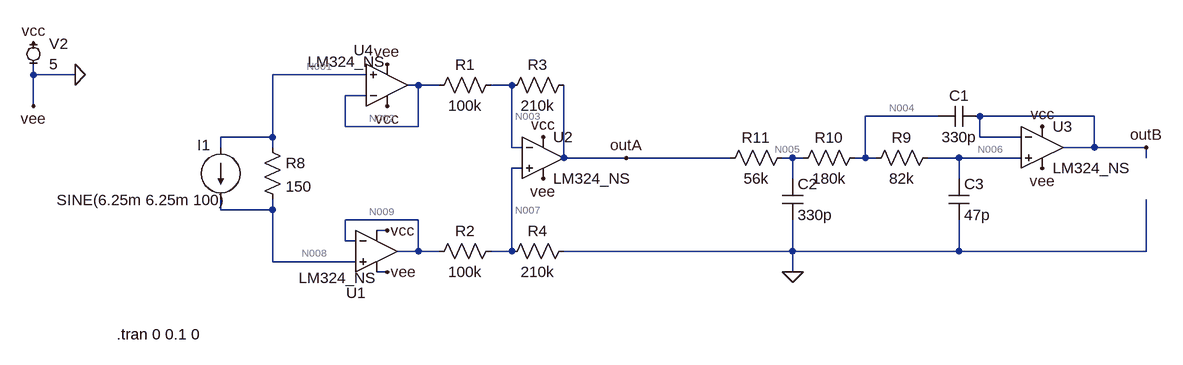
[diagram p0: schematic current_sense_alt.asc]
* current_sense_alt.asc
R3 N003 outA 210k
R4 N007 0 210k
V2 vcc 0 5
R8 N001 N008 150
I1 N001 N008 SINE(6.25m 6.25m 100)
C1 N004 outB 330p
R9 N004 N006 82k
R10 N005 N004 180k
R11 outA N005 56k
C2 N005 0 330p
C3 N006 0 47p
* U1: LM324_NS (symbol EXTRA\ExtraOpamps\LM324_NS not available, pins judged from their places): In+=N008 In-=N009 V+=vcc V-=0 OUT=N009
* U2: LM324_NS (symbol EXTRA\ExtraOpamps\LM324_NS not available, pins judged from their places): In+=N007 In-=N003 V+=vcc V-=0 OUT=outA
* U3: LM324_NS (symbol EXTRA\ExtraOpamps\LM324_NS not available, pins judged from their places): In+=N006 In-=outB V+=vcc V-=0 OUT=outB
* U4: LM324_NS (symbol EXTRA\ExtraOpamps\LM324_NS not available, pins judged from their places): In+=N001 In-=N002 V+=vcc V-=0 OUT=N002
R1 N003 N002 100k
R2 N007 N009 100k
.tran 0 0.1 0
.backanno
.end

* Results of the author's LTspice run, read from the files saved beside the schematic
* Operating Point, zero values left out:
*   V(n003) = 2.724 V
*   V(outa) = 1.84 V
*   V(n007) = 2.722 V
*   V(vcc) = 5 V
*   V(n001) = 3.139 V
*   V(n008) = 4.076 V
*   V(n004) = 1.852 V
*   V(outb) = 1.859 V
*   V(n006) = 1.857 V
*   V(n005) = 1.843 V
*   V(n009) = 4.012 V
*   V(n002) = 3.141 V
*   I(I1) = 6.25 mA
*   I(R2) = -12.91 µA
*   I(R1) = -4.169 µA
*   I(R11) = -51.94 nA
*   I(R10) = -51.94 nA
*   I(R9) = -51.94 nA
*   I(R8) = -6.25 mA
*   I(R4) = 12.96 µA
*   I(R3) = 4.207 µA
*   I(V2) = 178.7 µA
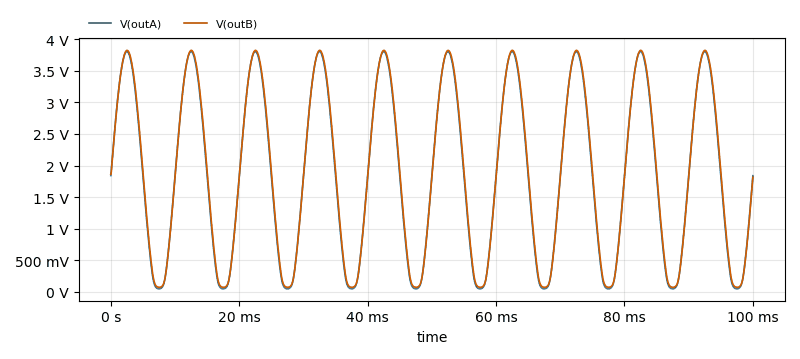
[diagram p1: Transient Analysis of current_sense_alt.asc, plotted from the saved traces]
* Transient Analysis, 1 run:
*   V(outA): min 46.11 mV, max 3.807 V, average 1.86 V, rms 2.308 V, last 1.839 V
*   V(outB): min 69.43 mV, max 3.825 V, average 1.879 V, rms 2.322 V, last 1.815 V